# Altium schematic sheet TOP.SchDoc
size A4; CompanyName: WEITI ISE; Address1: ul. Nowowiejska 15/19; Address2: 00-665 Warszawa; DocumentNumber: 1; SheetNumber: 1; SheetTotal: 7
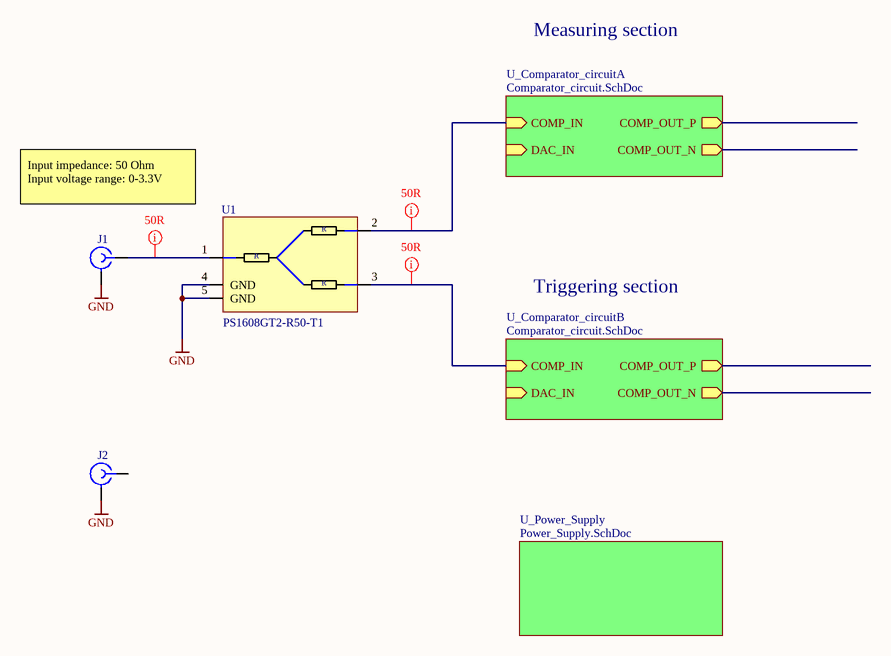
[diagram p0: TOP.SchDoc]

## Parts
J1  CONSMA020.062-G  (value not drawn)
J2  CONSMA020.062-G  (value not drawn)
U1  PS1608GT2-R50-T1

## Sub-sheets
U_Comparator_circuitA = Comparator_circuit.SchDoc: COMP_IN (in), DAC_IN (in), COMP_OUT_P (out), COMP_OUT_N (out)
U_Comparator_circuitB = Comparator_circuit.SchDoc: COMP_IN (in), DAC_IN (in), COMP_OUT_P (out), COMP_OUT_N (out)
U_Power_Supply = Power_Supply.SchDoc: no entries

## Nets
GND: J1.2 U1.4(GND) U1.5(GND)
NetJ1_1: J1.1 U1.1
NetU1_2: U1.2 ; sheet U_Comparator_circuitA/COMP_IN
NetU1_3: U1.3 ; sheet U_Comparator_circuitB/COMP_IN

Not connected (* = marked no-connect by the designer): J2 1 2

## Layout directives
mark named 50R: NetJ1_1, NetU1_2, NetU1_3

## Notes on the sheet
- Measuring section
- Input impedance: 50 Ohm
  Input voltage range: 0-3.3V
- Triggering section
- Labels drawn without touching a wire or pin: GND
- Project:
- Title
- File:
- Drawn by:
- Engineer:
- Checked by:
- Szymon Jedliński
- Sheet:
- Revision:
- Total Sheet:
- 1.0
- Variant:
- Approved by:
- Date:
- (in symbol PS1608GT2-R50-T1) R

## Library data of the parts
J1 J2 = CONSMA020.062-G: Coaxial Connectors SMA, Edge Mount, Female Receptacle, 0.062" PCB Mount, Gold; Manufacturer 1 Component Height: 7.92mm; DesignItemId: CONSMA020.062-G; HelpURL: https://www.mouser.pl/datasheet/2/418/9/ENG_DS_L9000279_01_A-3238972.pdf; Manufacturer Part Number: CONSMA020.062-G; SMD: Yes
U1 = PS1608GT2-R50-T1: Signal Conditioning 50 ohm 2 terminal Power Splitter; Manufacturer 1 Component Height: 0.5mm; DesignItemId: PS1608GT2-R50-T1; HelpURL: https://www.mouser.pl/datasheet/2/392/n_catalog_partition31_en-1660522.pdf; Manufacturer Part Number: PS1608GT2-R50-T1; SMD: Yes; Value: PS1608GT2-R50-T1